# Altium schematic sheet Proximity Sensor.SchDoc
size A
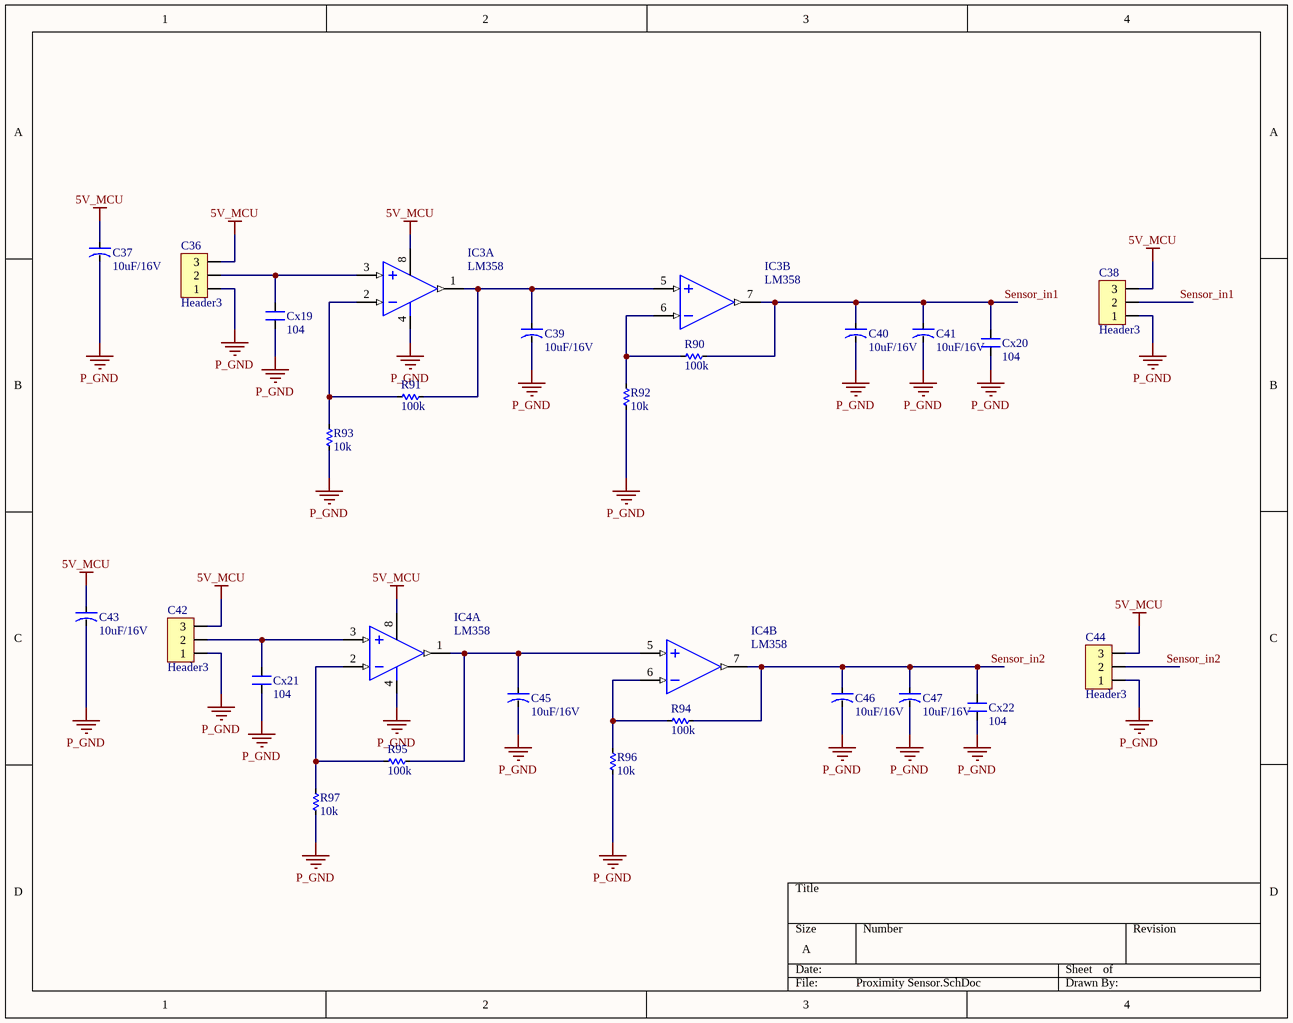
[diagram p0: Proximity Sensor.SchDoc]

## Parts
C36  Header3  [Header3]
C37  10uF/16V  [TANTALUM-3216]
C38  Header3  [Header3]
C39  10uF/16V  [TANTALUM-3216]
C40  10uF/16V  [TANTALUM-3216]
C41  10uF/16V  [TANTALUM-3216]
C42  Header3  [Header3]
C43  10uF/16V  [TANTALUM-3216]
C44  Header3  [Header3]
C45  10uF/16V  [TANTALUM-3216]
C46  10uF/16V  [TANTALUM-3216]
C47  10uF/16V  [TANTALUM-3216]
Cx19  104  [CN-SMD-0805]
Cx20  104  [CN-SMD-0805]
Cx21  104  [CN-SMD-0805]
Cx22  104  [CN-SMD-0805]
IC3  LM358  [SO8]  (parts A,B of 2)
IC4  LM358  [SO8]  (parts A,B of 2)
R90  100k  [RES-SMD-0805]
R91  100k  [RES-SMD-0805]
R92  10k  [RES-SMD-0805]
R93  10k  [RES-SMD-0805]
R94  100k  [RES-SMD-0805]
R95  100k  [RES-SMD-0805]
R96  10k  [RES-SMD-0805]
R97  10k  [RES-SMD-0805]

## Nets
5V_MCU: C36.3 C37.1 C38.3 C42.3 C43.1 C44.3 IC3.8(+V) IC4.8(+V)
P_GND: C36.1 C37.2 C38.1 C39.2 C40.2 C41.2 C42.1 C43.2 C44.1 C45.2 C46.2 C47.2 Cx19.1 Cx20.1 Cx21.1 Cx22.1 IC3.4(-V) IC4.4(-V) R92.2 R93.2 R96.2 R97.2
Sensor_in1: C38.2 C40.1 C41.1 Cx20.2 IC3.7(OUT) R90.1
Sensor_in2: C44.2 C46.1 C47.1 Cx22.2 IC4.7(OUT) R94.1
NetC36_2: C36.2 Cx19.2 IC3.3(IN+)
NetC39_1: C39.1 IC3.1(OUT) IC3.5(IN+) R91.1
NetC42_2: C42.2 Cx21.2 IC4.3(IN+)
NetC45_1: C45.1 IC4.1(OUT) IC4.5(IN+) R95.1
NetIC3_2: IC3.2(IN-) R91.2 R93.1
NetIC3_6: IC3.6(IN-) R90.2 R92.1
NetIC4_2: IC4.2(IN-) R95.2 R97.1
NetIC4_6: IC4.6(IN-) R94.2 R96.1

## Library data of the parts
C36 C38 C42 C44 = Header3: Header IDC, 3 x 1 Pin Vertical 2.54mm Pitch (Non-Boxed, Male); Manufacturer: W¨¹rth Elektronik eiSos GmbH; partNo: 613002143121; ComponentLink1 Description: Manufacturer; ComponentLink2 Description: Datasheet; NoPins: 02; Created Date: 29 March 2013; ComponentLink1URL: http://www.we-online.com; ComponentLink2URL: http://katalog.we-online.de/em/datasheet/6130xx143121.pdf; Created by: Karrer Zheng
C37 C39-C41 C43 C45-C47 = CN-TANTALUM-SMD
Cx19-Cx22 = CN: Value: 33pF
IC3 IC4 = LM358: Low-Power Dual Operational Amplifier; Value: LM358
R90-R97 = Res-SMD: Resistor; Manufacturer: Generic Components; Class: Passive; Published: 08/06/2000; Publisher: Altium Hobart Technology Centre